# EAGLE design W532B (EAGLE 6.6.0)
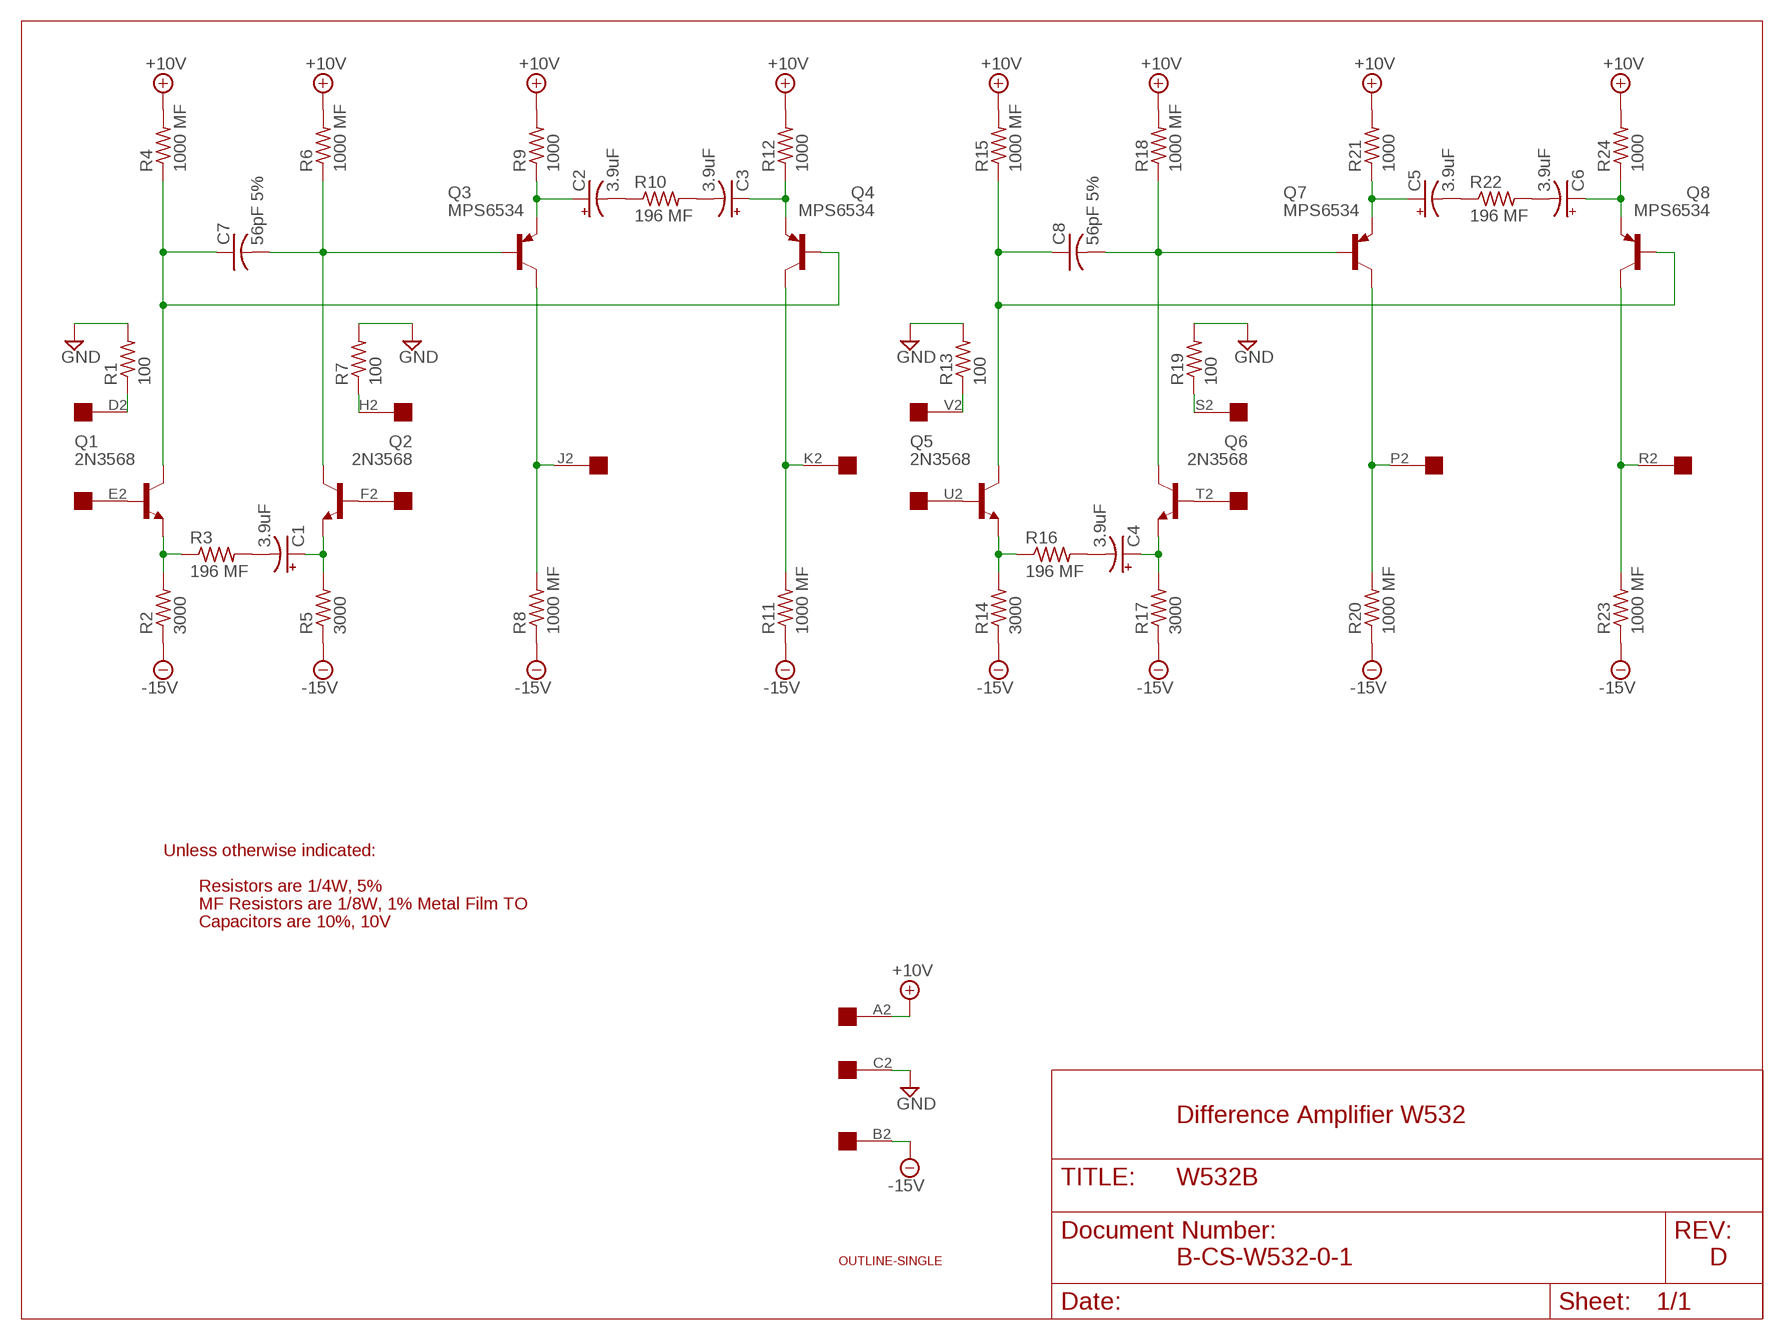
[diagram p0: schematic, sheet 1]

## Parts
C1  3.9uF  CPOL-USE15-5AXIAL  [E15-5]
C2  3.9uF  CPOL-USE15-5AXIAL  [E15-5]
C3  3.9uF  CPOL-USE15-5AXIAL  [E15-5]
C4  3.9uF  CPOL-USE15-5AXIAL  [E15-5]
C5  3.9uF  CPOL-USE15-5AXIAL  [E15-5]
C6  3.9uF  CPOL-USE15-5AXIAL  [E15-5]
C7  56pF 5%  C-US150-054X183  [C150-054X183]
C8  56pF 5%  C-US150-054X183  [C150-054X183]
Q1  2N3568  2N2102  [TO5]
Q2  2N3568  2N2102  [TO5]
Q3  MPS6534  2N2904  [TO39]
Q4  MPS6534  2N2904  [TO39]
Q5  2N3568  2N2102  [TO5]
Q6  2N3568  2N2102  [TO5]
Q7  MPS6534  2N2904  [TO39]
Q8  MPS6534  2N2904  [TO39]
R1  100  R-US_0207/10  [0207/10]
R2  3000  R-US_0207/10  [0207/10]
R3  196 MF  R-US_0207/15  [0207/15]
R4  1000 MF  R-US_0207/15  [0207/15]
R5  3000  R-US_0207/10  [0207/10]
R6  1000 MF  R-US_0207/15  [0207/15]
R7  100  R-US_0207/10  [0207/10]
R8  1000 MF  R-US_0207/15  [0207/15]
R9  1000  R-US_0207/10  [0207/10]
R10  196 MF  R-US_0207/15  [0207/15]
R11  1000 MF  R-US_0207/15  [0207/15]
R12  1000  R-US_0207/10  [0207/10]
R13  100  R-US_0207/10  [0207/10]
R14  3000  R-US_0207/10  [0207/10]
R15  1000 MF  R-US_0207/15  [0207/15]
R16  196 MF  R-US_0207/15  [0207/15]
R17  3000  R-US_0207/10  [0207/10]
R18  1000 MF  R-US_0207/15  [0207/15]
R19  100  R-US_0207/10  [0207/10]
R20  1000 MF  R-US_0207/15  [0207/15]
R21  1000  R-US_0207/10  [0207/10]
R22  196 MF  R-US_0207/15  [0207/15]
R23  1000 MF  R-US_0207/15  [0207/15]
R24  1000  R-US_0207/10  [0207/10]
U$1  OUTLINE-SINGLE  [SINGLE]
U$2  EDGE-1  [EDGE-CON1]

## Nets
+10V [Supply]: R4.2 R6.2 R9.2 R12.2 R15.2 R18.2 R21.2 R24.2 U$2.A2
-15V [Supply]: R2.1 R5.1 R8.1 R11.1 R14.1 R17.1 R20.1 R23.1 U$2.B2
GND [Supply]: R1.2 R7.2 R13.2 R19.2 U$2.C2
N$1: C2.- R10.1
N$2: C3.- R10.2
N$3: C2.+ Q3.1(E) R9.1
N$4: C3.+ Q4.1(E) R12.1
N$5: C7.1 Q1.3(C) Q4.2(B) R4.1
N$6: C7.2 Q2.3(C) Q3.2(B) R6.1
N$7: Q3.3(C) R8.2 U$2.J2
N$8: Q4.3(C) R11.2 U$2.K2
N$9: C1.- R3.2
N$10: Q1.2(B) U$2.E2
N$11: Q2.2(B) U$2.F2
N$12: R1.1 U$2.D2
N$13: R7.1 U$2.H2
N$14: Q1.1(E) R2.2 R3.1
N$15: C1.+ Q2.1(E) R5.2
N$16: C5.- R22.1
N$17: C6.- R22.2
N$18: C5.+ Q7.1(E) R21.1
N$19: C6.+ Q8.1(E) R24.1
N$20: C8.2 Q6.3(C) Q7.2(B) R18.1
N$21: C8.1 Q5.3(C) Q8.2(B) R15.1
N$22: Q7.3(C) R20.2 U$2.P2
N$23: Q8.3(C) R23.2 U$2.R2
N$24: C4.- R16.2
N$25: Q5.2(B) U$2.U2
N$26: Q6.2(B) U$2.T2
N$27: R13.1 U$2.V2
N$28: R19.1 U$2.S2
N$29: Q5.1(E) R14.2 R16.1
N$30: C4.+ Q6.1(E) R17.2
Unconnected: U$2.L2 U$2.M2 U$2.N2

## Notes on the sheet
- Unless otherwise indicated:
- Resistors are 1/4W, 5%
- MF Resistors are 1/8W, 1% Metal Film TO
- Capacitors are 10%, 10V
- Difference Amplifier W532
- B-CS-W532-0-1 | D

## Library data of the parts
C1-C6 = rcl:CPOL-US: POLARIZED CAPACITOR, American symbol
C7 C8 = rcl:C-US: CAPACITOR, American symbol
Q1 Q2 Q5 Q6 = transistor:2N2102: NPN TRANSISTOR
Q3 Q4 Q7 Q8 = transistor-pnp:2N2904*: PNP Transistror
R1-R24 = rcl:R-US_: RESISTOR, American symbol
U$1 = dec-con:OUTLINE-*: Board outlines for DEC boards.
U$2 = dec-con:EDGE-1: Single-Sided DEC Edge Connector -- (side 2)

## Net classes
1 Supply: width 0.813 mm

## Board
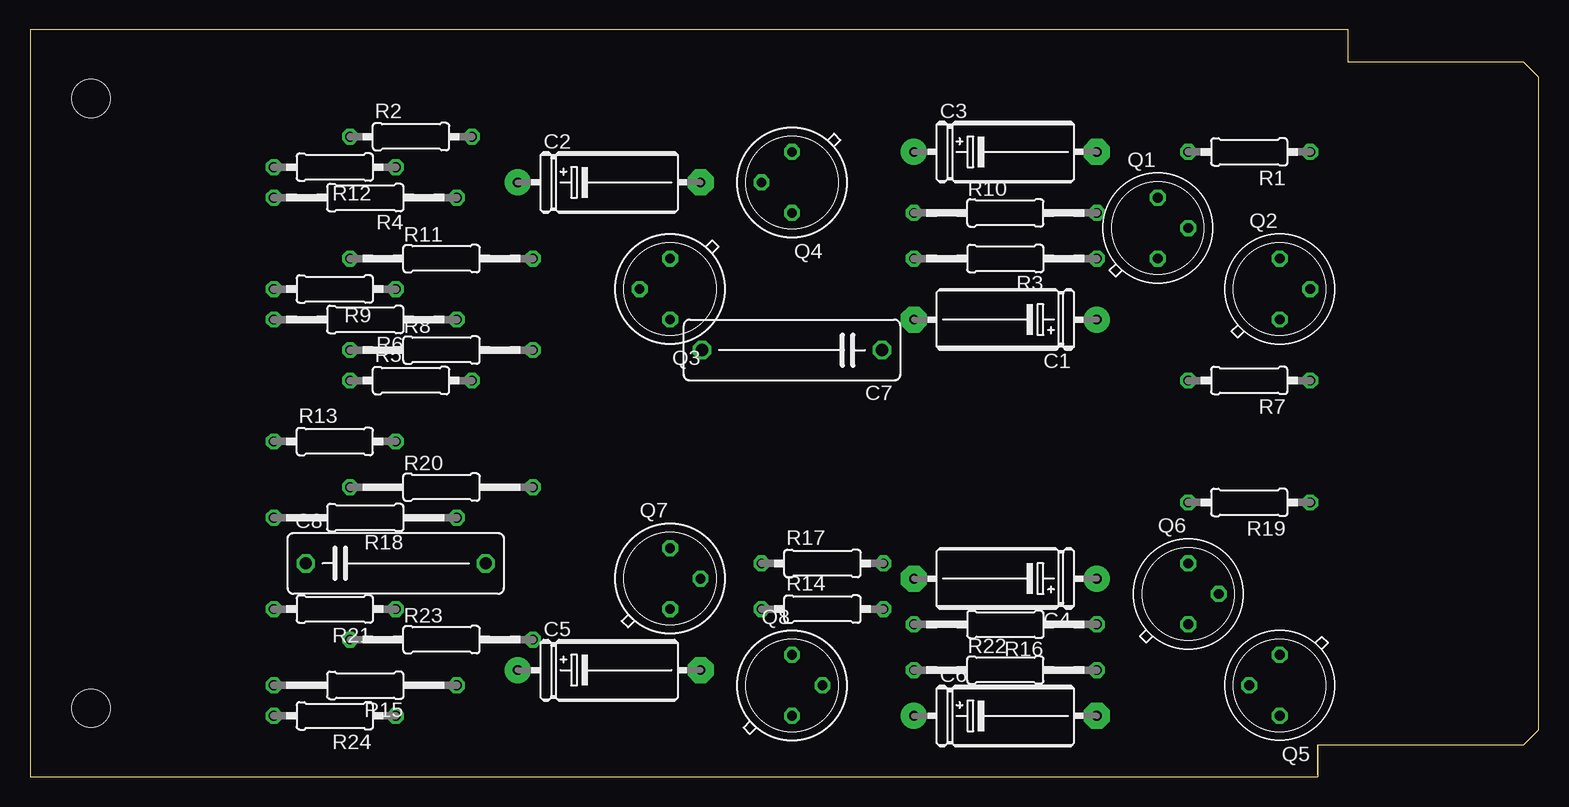
[diagram p1: board, top side]
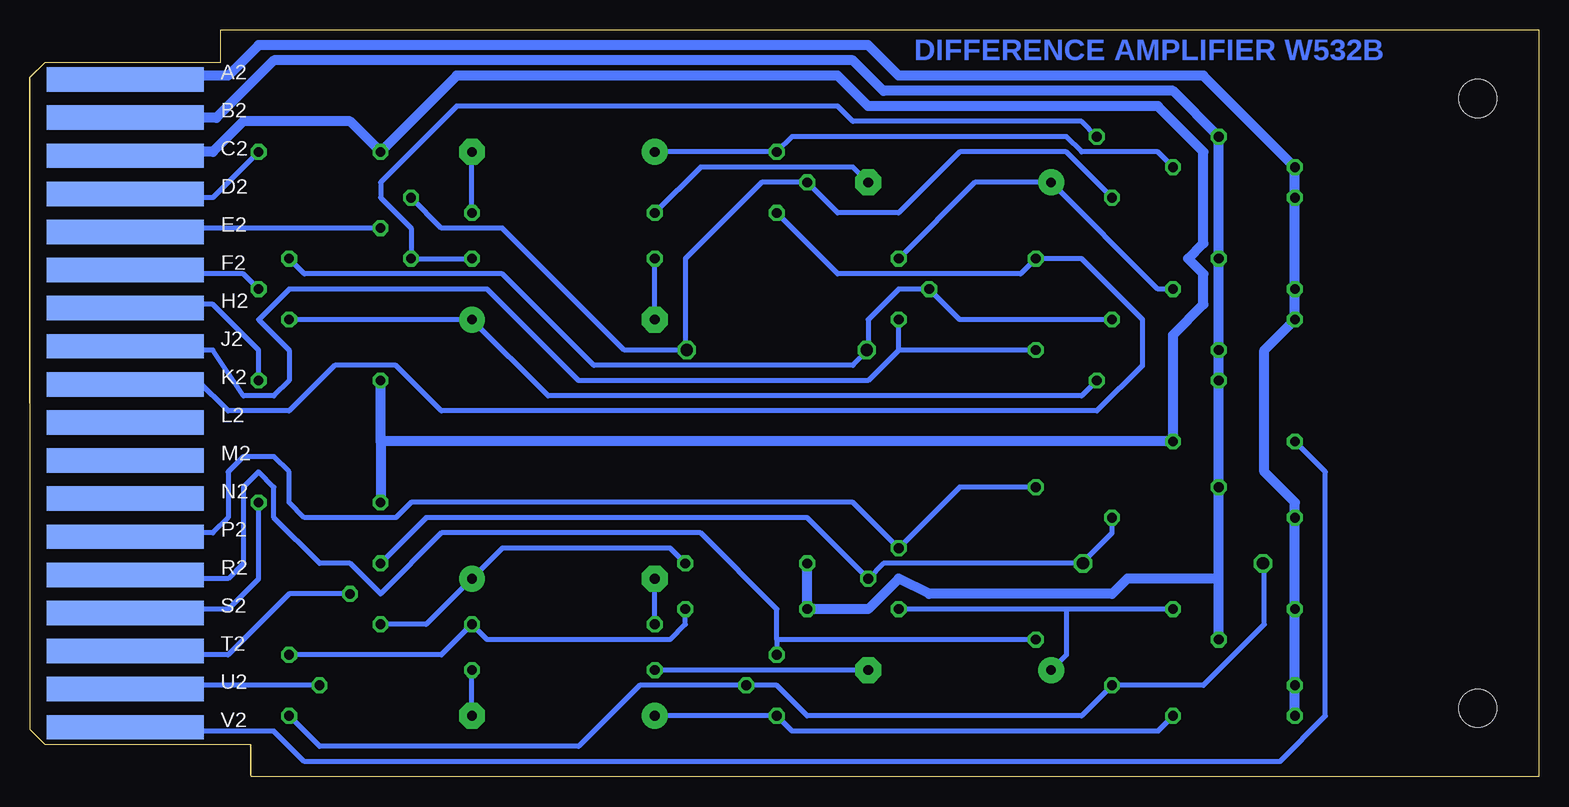
[diagram p2: board, bottom side, seen from below]

Size 125.73 x 62.23 mm. Coordinates in mm from the lower left corner, seen from the top.
Copper layers (1+16): Top 0.035mm / dielectric 1.5mm / Bottom 0.035mm
Design rules "16mils": minimum track width 16mil, minimum drill 32mil, track to track 15mil, track to pad 10mil, pad to pad 10mil, via to via 10mil, smd to smd 10mil, copper to edge 13mil, drill to drill 10mil, minimum pad ring 10mil, minimum via ring 8mil, stop-mask expansion 0mil, vias tented up to drill 0mil, thermal gap 10mil

### Footprints (pad centres in the part's own frame; a part is rotated, then mirrored left to right if it is on the bottom)
E15-5 = drill 0.813 pad 2.159: + -7.62,0 | drill 0.813 pad 2.159 octagon: - 7.62,0
C150-054X183 = drill 1.016 octagon: 1 -7.493,0; 2 7.493,0
TO5 = drill 0.813 octagon: 1 0,-2.54; 2 2.54,0; 3 0,2.54
TO39 = drill 0.813 octagon: 1 0,-2.54; 2 2.54,0; 3 0,2.54
0207/10 = drill 0.813 octagon: 1 -5.08,0; 2 5.08,0
0207/15 = drill 0.813 octagon: 1 -7.62,0; 2 7.62,0
SINGLE = hole 3.175: 120.65,56.515; 120.65,5.715
EDGE-CON1 = smd 13.106 x 2.032 bottom: A2 7.938,4.128; B2 7.938,7.303; C2 7.938,10.477; D2 7.938,13.652; E2 7.938,16.828; F2 7.938,20.003; H2 7.938,23.177; J2 7.938,26.352; K2 7.938,29.527; L2 7.938,32.703; M2 7.938,35.877; N2 7.938,39.053; P2 7.938,42.227; R2 7.938,45.403; S2 7.938,48.578; T2 7.938,51.752; U2 7.938,54.928; V2 7.938,58.102

### Placement (x,y rotation side)
C1  81.28,38.1 180 top
C2  48.26,49.53 0 top
C3  81.28,52.07 0 top
C4  81.28,16.51 180 top
C5  48.26,8.89 0 top
C6  81.28,5.08 0 top
C7  63.5,35.56 180 top
C8  30.48,17.78 0 top
Q1  93.98,45.72 0 top
Q2  104.14,40.64 0 top
Q3  53.34,40.64 180 top
Q4  63.5,49.53 180 top
Q5  104.14,7.62 180 top
Q6  96.52,15.24 0 top
Q7  53.34,16.51 0 top
Q8  63.5,7.62 0 top
R1  101.6,52.07 180 top
R2  31.75,53.34 0 top
R3  81.28,43.18 180 top
R4  27.94,48.26 180 top
R5  31.75,33.02 0 top
R6  27.94,38.1 180 top
R7  101.6,33.02 180 top
R8  34.29,35.56 0 top
R9  25.4,40.64 180 top
R10  81.28,46.99 0 top
R11  34.29,43.18 0 top
R12  25.4,50.8 180 top
R13  25.4,27.94 0 top
R14  66.04,13.97 0 top
R15  27.94,7.62 180 top
R16  81.28,12.7 180 top
R17  66.04,17.78 0 top
R18  27.94,21.59 180 top
R19  101.6,22.86 180 top
R20  34.29,24.13 0 top
R21  25.4,13.97 180 top
R22  81.28,8.89 0 top
R23  34.29,11.43 0 top
R24  25.4,5.08 180 top
U$1  125.73,62.23 180 top
U$2  125.73,62.23 180 top

### Tracks (layer width: path | path; a pad name or v marks a point on that pad's centre or on a via)
+10V
  Bottom 0.813: R24.2 R15.2 R21.2 R18.2 20.32,22.86 22.86,25.4 22.86,35.56 R6.2 R9.2 R4.2 R12.2 27.94,58.42 53.34,58.42 55.88,60.96 106.68,60.96 109.22,58.42 116.84,58.42 117.22,58.04 U$2.A2
-15V
  Bottom 0.813: U$2.B2 110.2,54.9 105.41,59.69 57.15,59.69 54.61,57.15 30.48,57.15 R2.1 R11.1 R8.1 R5.1 R20.1 26.67,16.51 | R23.1 26.67,16.51 | R17.1 R14.1 55.88,13.97 53.34,16.51 50.8,15.24 35.56,15.24 34.29,16.51 26.67,16.51
GND
  Bottom 0.813: 96.52,27.94 R19.2 | 96.52,27.94 R7.2 | U$2.C2 115.9,51.74 115.57,52.07 110.49,52.07 107.95,54.61 99.06,54.61 R1.2 90.17,58.42 58.42,58.42 55.88,55.88 31.75,55.88 27.94,52.07 27.94,44.45 29.21,43.18 27.94,41.91 27.94,39.37 30.48,36.83 R13.2 96.52,27.94
N$1
  Bottom 0.406: C2.- 57.15,50.8 69.85,50.8 R10.1
N$2
  Bottom 0.406: R10.2 C3.-
N$3
  Bottom 0.406: R9.1 31.75,40.64 C2.+ 46.99,49.53 Q3.1
N$4
  Bottom 0.406: R12.1 31.75,52.07 38.1,52.07 39.37,53.34 62.23,53.34 Q4.1 C3.+
N$5
  Bottom 0.406: R4.1 39.37,52.07 48.26,52.07 53.34,46.99 58.42,46.99 Q4.2 64.77,49.53 71.12,43.18 71.12,35.56 | Q1.3 91.44,45.72 86.36,45.72 76.2,35.56 71.12,35.56 | 71.12,35.56 C7.1
N$6
  Bottom 0.406: 55.88,35.56 C7.2 | 55.88,35.56 55.88,38.1 53.34,40.64 Q3.2 48.26,38.1 R6.1 | Q2.3 102.87,41.91 86.36,41.91 78.74,34.29 57.15,34.29 55.88,35.56
N$7
  Bottom 0.406: U$2.J2 117.17,35.89 116.84,35.56 110.49,35.56 107.95,31.75 105.41,31.75 104.14,33.02 104.14,35.56 106.68,38.1 104.14,40.64 87.63,40.64 80.01,33.02 55.88,33.02 53.34,35.56 | R8.2 53.34,35.56 | 53.34,35.56 Q3.3
N$8
  Bottom 0.406: U$2.K2 114.61,32.72 114.3,33.02 111.76,33.02 109.22,30.48 104.14,30.48 100.33,34.29 95.25,34.29 91.44,30.48 36.83,30.48 33.02,34.29 33.02,38.1 38.1,43.18 R11.2 43.18,41.91 58.42,41.91 Q4.3
N$9
  Bottom 0.406: C1.- R3.2
N$10
  Bottom 0.406: U$2.E2 117.17,45.39 116.84,45.72 Q1.2
N$11
  Bottom 0.406: U$2.F2 117.12,42.19 116.84,41.91 107.95,41.91 Q2.2
N$12
  Bottom 0.406: U$2.D2 117.14,48.56 116.84,48.26 110.49,48.26 R1.1
N$13
  Bottom 0.406: U$2.H2 117.17,39.04 116.84,39.37 110.49,39.37 106.68,35.56 R7.1
N$14
  Bottom 0.406: R2.2 38.1,54.61 57.15,54.61 58.42,55.88 90.17,55.88 96.52,49.53 96.52,48.26 93.98,45.72 Q1.1 R3.1
N$15
  Bottom 0.406: R5.2 38.1,31.75 82.55,31.75 C1.+ Q2.1
N$16
  Bottom 0.406: C5.- R22.1
N$17
  Bottom 0.406: C6.- R22.2
N$18
  Bottom 0.406: R21.1 39.37,13.97 | 39.37,13.97 39.37,10.16 C5.+ | 39.37,13.97 Q7.1
N$19
  Bottom 0.406: R24.1 31.75,3.81 62.23,3.81 Q8.1 C6.+
N$20
  Bottom 0.406: Q6.3 92.71,21.59 60.96,21.59 Q7.2 54.61,17.78 C8.2 37.97,17.91 35.56,20.32 R18.1
N$21
  Bottom 0.406: C8.1 22.86,17.78 22.86,12.7 27.94,7.62 R15.1 38.1,5.08 60.96,5.08 63.5,7.62 Q8.2 74.93,7.62 80.01,2.54 101.6,2.54 Q5.3
N$22
  Bottom 0.406: U$2.P2 117.17,19.99 116.84,20.32 110.49,20.32 109.22,21.59 109.22,25.4 107.95,26.67 105.41,26.67 104.14,25.4 104.14,22.86 102.87,21.59 95.25,21.59 93.98,22.86 57.15,22.86 Q7.3 48.26,24.13 R20.2
N$23
  Bottom 0.406: U$2.R2 117.17,16.84 116.84,16.51 109.22,16.51 107.95,17.78 107.95,24.13 106.68,25.4 105.41,24.13 105.41,21.59 101.6,17.78 99.06,17.78 96.52,15.24 91.44,20.32 69.85,20.32 63.5,13.97 63.5,11.43 | R23.2 63.5,11.43 | 63.5,11.43 Q8.3
N$24
  Bottom 0.406: R16.2 C4.-
N$25
  Bottom 0.406: U$2.U2 117.2,7.26 116.84,7.62 Q5.2
N$26
  Bottom 0.406: U$2.T2 117.17,10.49 116.84,10.16 109.22,10.16 104.14,15.24 Q6.2
N$27
  Bottom 0.406: U$2.V2 117.16,4.13 116.84,3.81 105.41,3.81 102.87,1.27 21.59,1.27 17.78,5.08 17.78,25.4 R13.1
N$28
  Bottom 0.406: U$2.S2 116.84,13.66 116.84,13.97 109.22,13.97 106.68,16.51 R19.1
N$29
  Bottom 0.406: Q5.1 91.44,10.16 R16.1 87.63,11.43 72.39,11.43 71.12,12.7 R14.2
N$30
  Bottom 0.406: Q6.1 92.71,12.7 C4.+ 86.36,19.05 72.39,19.05 R17.2

### Text on the board
Bottom: DIFFERENCE AMPLIFIER W532B